# Altium schematic sheet Drone BLDC CNTR V2.SchDoc
size A3; SheetNumber: 1; SheetTotal: 1
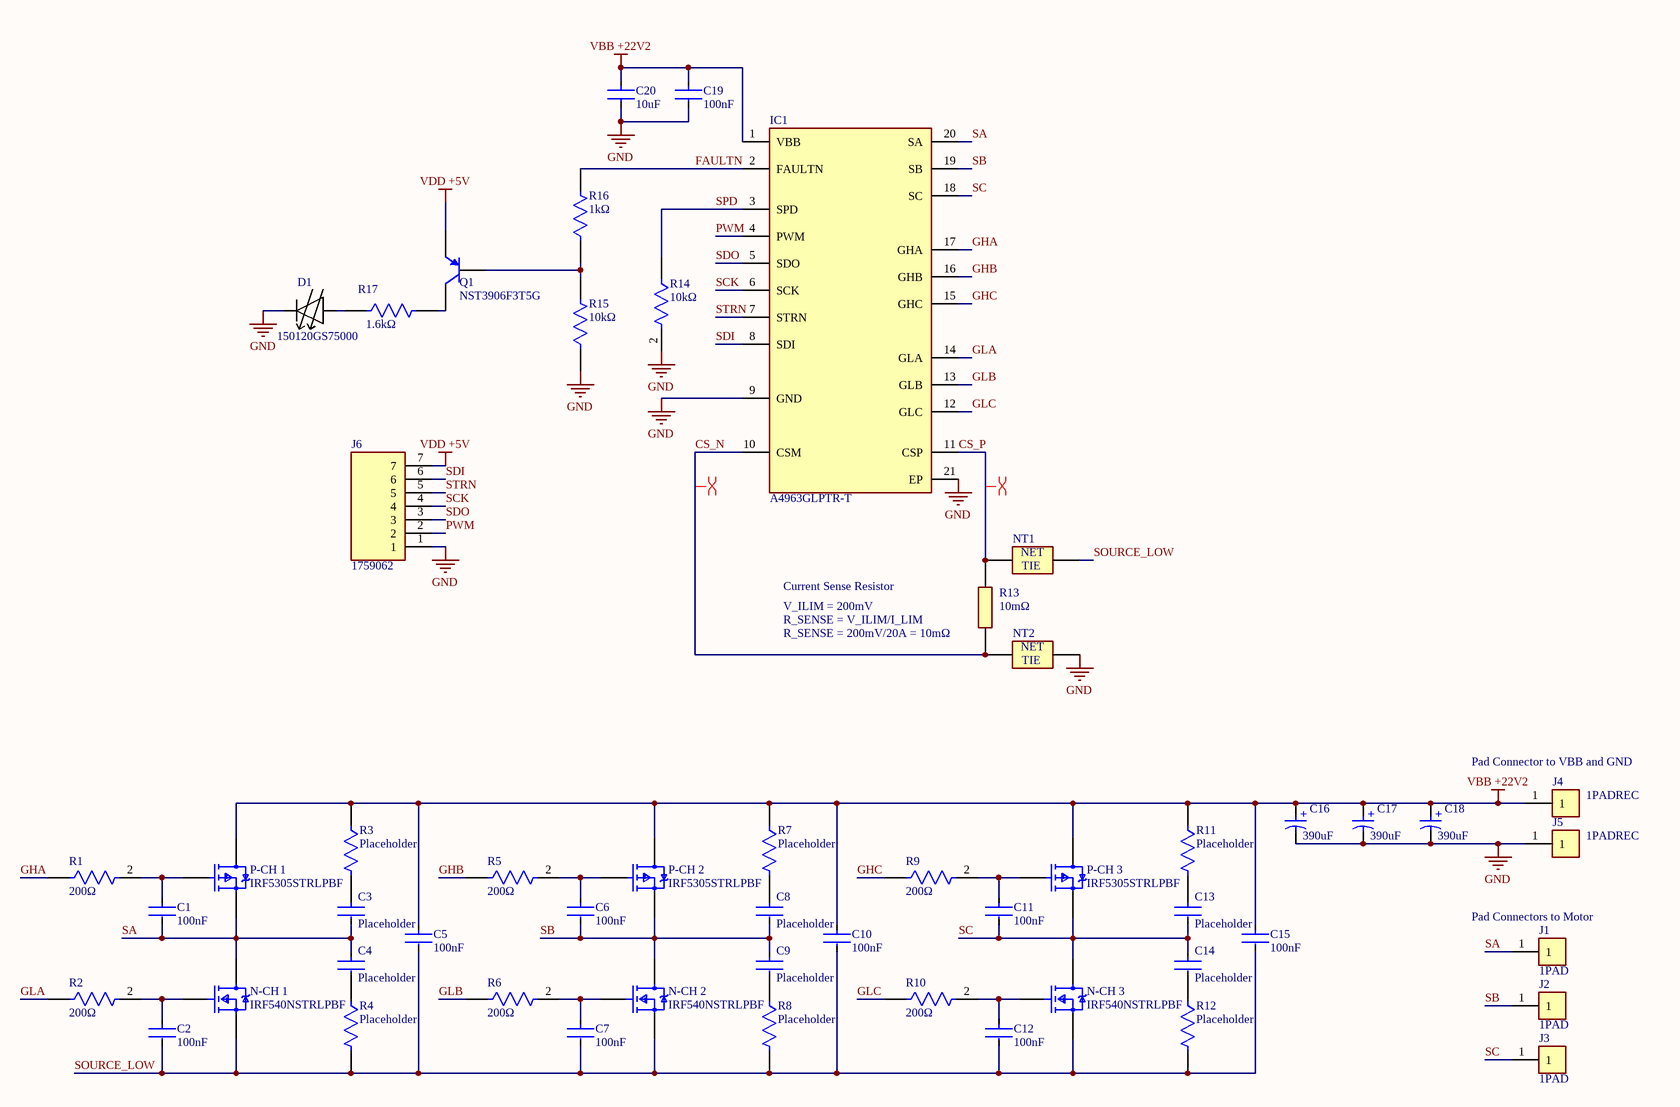
[diagram p0: Drone BLDC CNTR V2.SchDoc]

## Parts
C1  100nF  [FP-CL31-IPC_C]
C2  100nF  [FP-CL31-IPC_C]
C3  Placeholder  [FP-CL31-IPC_C]
C4  Placeholder  [FP-CL31-IPC_C]
C5  100nF  [FP-CL31-IPC_C]
C6  100nF  [FP-CL31-IPC_C]
C7  100nF  [FP-CL31-IPC_C]
C8  Placeholder  [FP-CL31-IPC_C]
C9  Placeholder  [FP-CL31-IPC_C]
C10  100nF  [FP-CL31-IPC_C]
C11  100nF  [FP-CL31-IPC_C]
C12  100nF  [FP-CL31-IPC_C]
C13  Placeholder  [FP-CL31-IPC_C]
C14  Placeholder  [FP-CL31-IPC_C]
C15  100nF  [FP-CL31-IPC_C]
C16  390uF  [WCAP-ASLI_D6.3H5.5]
C17  390uF  [WCAP-ASLI_D6.3H5.5]
C18  390uF  [WCAP-ASLI_D6.3H5.5]
C19  100nF  [FP-CL31-IPC_C]
C20  10uF  [FP-CL10-IPC_C]
D1  150120GS75000  [150120GS75000]
IC1  A4963GLPTR-T  [A4405KLPTRT]
J1  1PAD  [1PAD]
J2  1PAD  [1PAD]
J3  1PAD  [1PAD]
J4  1PADREC  [1PADREC]
J5  1PADREC  [1PADREC]
J6  1759062  [SHDRRA7W103P0X508_1X7_3556X1200X872P]
N-CH_1  IRF540NSTRLPBF  [FP-PG-TO263-3-MFG]
N-CH_2  IRF540NSTRLPBF  [FP-PG-TO263-3-MFG]
N-CH_3  IRF540NSTRLPBF  [FP-PG-TO263-3-MFG]
NT1  NET_TIE  [NET_TIE]  (value not drawn)
NT2  NET_TIE  [NET_TIE]  (value not drawn)
P-CH_1  IRF5305STRLPBF  [FP-PG-TO263-3-MFG]
P-CH_2  IRF5305STRLPBF  [FP-PG-TO263-3-MFG]
P-CH_3  IRF5305STRLPBF  [FP-PG-TO263-3-MFG]
Q1  NST3906F3T5G  [ONSC-SOT-1123-3-524AA_V]
R1  200Ω  [FP-RMCF0805-MFG]
R2  200Ω  [FP-RMCF0805-MFG]
R3  Placeholder  [FP-RMCF0805-MFG]
R4  Placeholder  [FP-RMCF0805-MFG]
R5  200Ω  [FP-RMCF0805-MFG]
R6  200Ω  [FP-RMCF0805-MFG]
R7  Placeholder  [FP-RMCF0805-MFG]
R8  Placeholder  [FP-RMCF0805-MFG]
R9  200Ω  [FP-RMCF0805-MFG]
R10  200Ω  [FP-RMCF0805-MFG]
R11  Placeholder  [FP-RMCF0805-MFG]
R12  Placeholder  [FP-RMCF0805-MFG]
R13  10mΩ  [RESC7250X190N]
R14  10kΩ  [FP-RMCF0805-MFG]
R15  10kΩ  [FP-RMCF0805-MFG]
R16  1kΩ  [FP-RMCF0805-IPC_C]
R17  1.6kΩ  [FP-RMCF0805-IPC_C]

## Nets
GND: C16.2(N) C17.2(N) C18.2(N) C19.2 C20.2 D1.1 IC1.9(GND) IC1.21(EP) J5.1 J6.1 NT2.1 R14.2 R15.1
VBB +22V2: C5.1 C10.1 C15.1 C16.1(P) C17.1(P) C18.1(P) C19.1 C20.1 IC1.1(VBB) J4.1 P-CH_1.4(DRAIN) P-CH_2.4(DRAIN) P-CH_3.4(DRAIN) R3.1 R7.1 R11.1
VDD +5V: J6.7 Q1.2(E)
CS_N: IC1.10(CSM) NT2.2 R13.1
CS_P: IC1.11(CSP) NT1.2 R13.2
FAULTN: IC1.2(FAULTN) R16.2
GHA: IC1.17(GHA) R1.1
GHB: IC1.16(GHB) R5.1
GHC: IC1.15(GHC) R9.1
GLA: IC1.14(GLA) R2.1
GLB: IC1.13(GLB) R6.1
GLC: IC1.12(GLC) R10.1
PWM: IC1.4(PWM) J6.2
SA: C1.2 C3.2 C4.1 IC1.20(SA) J1.1 N-CH_1.4(DRAIN) P-CH_1.3(SOURCE)
SB: C6.2 C8.2 C9.1 IC1.19(SB) J2.1 N-CH_2.4(DRAIN) P-CH_2.3(SOURCE)
SC: C11.2 C13.2 C14.1 IC1.18(SC) J3.1 N-CH_3.4(DRAIN) P-CH_3.3(SOURCE)
SCK: IC1.6(SCK) J6.4
SDI: IC1.8(SDI) J6.6
SDO: IC1.5(SDO) J6.3
SOURCE_LOW: C2.2 C5.2 C7.2 C10.2 C12.2 C15.2 N-CH_1.3(SOURCE) N-CH_2.3(SOURCE) N-CH_3.3(SOURCE) NT1.1 R4.2 R8.2 R12.2
SPD: IC1.3(SPD) R14.1
STRN: IC1.7(STRN) J6.5
NetC1_1: C1.1 P-CH_1.1(GATE) R1.2
NetC2_1: C2.1 N-CH_1.1(GATE) R2.2
NetC3_1: C3.1 R3.2
NetC4_2: C4.2 R4.1
NetC6_1: C6.1 P-CH_2.1(GATE) R5.2
NetC7_1: C7.1 N-CH_2.1(GATE) R6.2
NetC8_1: C8.1 R7.2
NetC9_2: C9.2 R8.1
NetC11_1: C11.1 P-CH_3.1(GATE) R9.2
NetC12_1: C12.1 N-CH_3.1(GATE) R10.2
NetC13_1: C13.1 R11.2
NetC14_2: C14.2 R12.1
NetD1_2: D1.2 R17.1
NetQ1_1: Q1.1(B) R15.2 R16.1
NetQ1_3: Q1.3(C) R17.2

## Layout directives
differential pair: CS_N, CS_P

## Notes on the sheet
- V_ILIM = 200mV
- Current Sense Resistor
- R_SENSE = V_ILIM/I_LIM
- (near R13) R_SENSE = 200mV/20A = 10mΩ
- (near J4) Pad Connector to VBB and GND
- (near J1) Pad Connectors to Motor
- (in symbol CMP-03913-53914574-1) +
- (in symbol NET_TIE) NET; TIE

## Library data of the parts
C1-C15 C19 = CMP-13271-001731-1: Cap Ceramic 100nF 50V X7R ±10% SMD 1206 +125°C Embossed T/R; Voltage: 50V; Thickness: 0.037inch; Lead Free: Lead Free; Length: 3.2mm; Min Operating Temperature: -55°C; Package Quantity: 15000; Packaging: Tape and Reel; Mount: Surface Mount; Depth: 1.6mm; Case/Package: 1206; Voltage Rating (DC): 50V; Tolerance: 10%; Height: 0.85mm; Capacitance: 100nF; Radiation Hardening: No; Dielectric: X7R; Voltage Rating: 50V; Max Operating Temperature: 125°C; Width: 0.063inch
C16-C18 = CMP-03913-53914574-1: 865080343009 WCAP-ASLI Aluminum Electrolytic Capacitors; Capacitance: 100µF; Polarity: Polar; Voltage Rating: 16V; Life (Hours): 2000hours; Tolerance: 20%; Impedance: 520mΩ; Ripple Current: 255mA; ESR (Equivalent Series Resistance): 399.422mΩ; Leakage Current: 16µA; Insulation Resistance: 1MΩ; Height: 5.5mm; NexarPartId: 53914574; Length: 5.5mm; Max Operating Temperature: 105°C; Min Operating Temperature: -55°C; Case/Package: Radial; RoHS: Compliant; Mount: Surface Mount; Lead Free: Lead Free; Voltage Rating (DC): 16V; Packaging: Tape & Reel (TR); Ripple Current (AC): 255mA; Diameter: 6.3mm; Height - Seated (Max): 5.5118mm; Width: 6.6mm; REACH SVHC: Unknown
C20 = CMP-13271-000193-1: Cap Ceramic 10nF 50V X7R ±20% Pad SMD 0603 +125°C T/R; Voltage Rating (DC): 50V; Radiation Hardening: No; Packaging: Tape and Reel; Depth: 0.8mm; Package Quantity: 4000; Max Operating Temperature: 125°C; Length: 1.6mm; Voltage Rating: 50V; Case/Package: 0603; Dielectric: X7R; Mount: Surface Mount; Tolerance: 20%; Thickness: 0.035inch; Capacitance: 10nF; Height: 0.8mm; Lead Free: Lead Free; Case Code (Metric): 1608; Width: 0.031inch; Min Operating Temperature: -55°C; Case Code (Imperial): 0603
D1 = CMP-036-000001-1: Green Status LED 1206; Source: LED - Chip.SchLib; Design Item ID: 150120GS75000; ComponentLink1Description: Schematic; ComponentLink1URL: https://katalog.we-online.de/led/datasheet/150120GS75000.pdf
IC1 = A4963GLPTR-T: Integrated Circuit; Manufacturer_Name: Allegro Microsystems; Datasheet Link: https://www.allegromicro.com/~/media/Files/Datasheets/A4963-Datasheet.ashx; Height: 1.2mm; Manufacturer_Part_Number: A4963GLPTR-T; Mouser Part Number: 250-A4963GLPTR-T; Mouser Price/Stock: https://www.mouser.co.uk/ProductDetail/Allegro-MicroSystems/A4963GLPTR-T?qs=pUKx8fyJudBsbRJaBUG8MA%3D%3D; Arrow Part Number: A4963GLPTR-T; Arrow Price/Stock: https://www.arrow.com/en/products/a4963glptr-t/allegro-microsystems?region=nac
J1-J3 = 1PAD: 1 Pad Connector
J4 J5 = 1PADREC: 1 Pad Rectangular Connector
J6 = 1759062: Connector; Manufacturer_Name: Phoenix Contact; Datasheet Link: http://www.phoenixcontact.com/de/produkte/1759062/pdf; Height: 8.72mm; Manufacturer_Part_Number: 1759062; Mouser Part Number: 651-1759062; Mouser Price/Stock: https://www.mouser.co.uk/ProductDetail/Phoenix-Contact/1759062?qs=cyzODkzcbwDJuRBXr3zqQw%3D%3D; Arrow Part Number: 1759062; Arrow Price/Stock: https://www.arrow.com/en/products/1759062/phoenix-contact
N-CH_1-N-CH_3 = CMP-00196-65873407-1: IRF540NSTRLPBF Transistor MOSFET N Channel 100 Volt 33 Amp 3-Pin 2+ Tab D2pak Tape And Reel; Drain to Source Voltage (Vdss): 100V; Rise Time: 35ns; Resistance: 44MΩ; Gate to Source Voltage (Vgs): 20V; Turn-Off Delay Time: 39ns; Recovery Time: 170ns; Number of Elements: 1; Max Junction Temperature (Tj): 175°C; Nominal Vgs: 4V; Element Configuration: Single; Current Rating: 33A; Power Dissipation: 3.8W; Turn-On Delay Time: 11ns; Input Capacitance: 1.96nF; Rds On Max: 8.4mΩ; Min Operating Temperature: -55°C; Lead Free: Lead Free; Packaging: Bulk; Voltage Rating (DC): 100V; Radiation Hardening: No; Height: 4.826mm; Schedule B: 8541290080, 8541290080; Mount: Surface Mount; Drain to Source Breakdown Voltage: 100V; Number of Pins: 3; Contact Plating: Tin; NexarPartId: 65873407; Max Operating Temperature: 175°C; Continuous Drain Current (ID): 33A; Termination: SMD/SMT; On-State Resistance: 44mΩ; Threshold Voltage: 4V; RoHS: Compliant; Dual Supply Voltage: 100V; Max Power Dissipation: 3.8W; Lifecycle Status: NRND; Width: 9.65mm; Drain to Source Resistance: 44mΩ; Fall Time: 35ns; Case/Package: D2PAK; Length: 10.668mm; Number of Channels: 1; Package Quantity: 800; REACH SVHC: No SVHC
NT1 NT2 = NET_TIE: Net Tie Pad
P-CH_1-P-CH_3 = CMP-32901-000146-1: MOSFET P-CH 55V 31A D2PAK; Manufacturer: Infineon Technologies; Input Capacitace At Vds: 1200pF @ -25V; Power Dissipation: 3.8W; Number Of Channels: 1; Gate Charge At Vgs: 63nC @ -10V; Turn Off Delay Time: 39ns; Threshold Vgs Min: -2V; Max Forward Diode Voltage: -1.3V; Reverse Recovery Charge: 170nC; Max Junction Temp: +175°C; Continuous Drain Current: -31A; Drain To Source Breakdown Voltage: -55V; Standoff Height: 0mm; Gate To Source Voltage: 20V; Reverse Recovery Time: 71ns; Depletion Mode: False; Drain To Source Resistance: 0.06Ω; Rthja Max: 40°C/W; Threshold Vgs Max: -4V; Turn On Delay Time: 14ns; Pulse Drain Current: -110A; Package: PG-TO263-3; Category: Trans; Automotive: No; Temperature Range High: +175°C; Number Of P Channels: 1; Height: 5.084mm; Device Class L2: Transistors; Device Class L3: MOSFETs; ComponentLink2URL: https://www.infineon.com/dgdl/irf5305spbf.pdf?fileId=5546d462533600a4015355e378101995; ComponentLink2Description: Datasheet; Temperature: -55°C to +175°C; RoHS: TRUE; Lead Free: Yes; Manufacturer Part Number: IRF5305STRLPBF; Temperature Range Low: -55°C; Digikey Description: MOSFET P-CH 55V 31A D2PAK; Drain To Source Voltage: -55V; Octopart: https://octopart.com/irf5305strlpbf-infineon-65873398; Device Class L1: Discrete Semiconductors
Q1 = CMP-1048-00442-1: PNP General Purpose Transistor, 3-Pin SOT-1123, Pb-Free, Tape and Reel; Manufacturer: On Semiconductor; IC Continuous (A): -0.2; fT Min (MHz): 250; Polarity: PNP; PartNumber: NST3906F3T5G; ComponentLink2URL: http://www.onsemi.com/pub_link/Collateral/NST3906F3-D.PDF; ComponentLink3Description: Package Specification; PackageReference: SOT-1123-3-524AA; RoHS: TRUE; ComponentLink2Description: Datasheet; DatasheetVersion: Rev. 1; PackageDescription: 3-Pin Small Outline Transistor, Body 0.8 x 0.6 mm, Pitch 0.375 mm; Packing: Tape and Reel; ComponentLink3URL: http://www.onsemi.cn/pub_link/Collateral/524AA.PDF; Mounting Technology: Surface Mount; ComponentLink1Description: Manufacturer URL; ComponentLink1URL: http://www.onsemi.com/; PackageVersion: Rev. C, 11/2011
R1-R12 R14 = CMP-26527-000524-1: 200Ω ±1% 0.125W 0805 Thick Film Chip Resistor AEC-Q200 compliant; Power Rating: 125mW; Temperature Coefficient: 100ppm/°C; Resistance: 200R; Packaging: Tape and Reel; Case Code (Imperial): 0805; Case/Package: 0805; Number of Terminations: 2; Depth: 1.25mm; Features: Automotive AEC-Q200; Max Power Dissipation: 125mW; Max Operating Temperature: 155°C; Series: RMCF; Mount: Surface Mount; Military Standard: Not; Radiation Hardening: No; Length: 0.079inch; Construction: Rectangular; Lead Free: Lead Free; Width: 0.049inch; Size Code: 0805; Height: 0.026inch; RoHS Compliant: Yes; Tolerance: 1%; Contact Plating: Tin; Resistor Type: Thick Film; Case Code (Metric): 2012; Min Operating Temperature: -55°C
R13 = HCSM2818FT10L0: 10mΩ 5W Resistor; Manufacturer_Name: Stackpole Electronics; Datasheet Link: https://cs.seielect.com/catalog/SEI-HCSM.pdf; Height: 1.9mm; Manufacturer_Part_Number: HCSM2818FT10L0; Arrow Part Number: HCSM2818FT10L0; Arrow Price/Stock: https://www.arrow.com/en/products/hcsm2818ft10l0/stackpole-electronics
R15 = CMP-26527-000121-1: RES 10K OHM 1% 1/8W 0805; Power Rating: 125mW; Resistance: 10kR; Temperature Coefficient: 100ppm/°C; Depth: 1.25mm; Construction: Rectangular; Packaging: Tape and Reel; Tolerance: 1%; Lead Free: Lead Free; Case/Package: 0805; RoHS Compliant: Yes; Series: RMCF; Width: 0.049inch; Max Power Dissipation: 125mW; Contact Plating: Tin; Height: 0.026inch; Mount: Surface Mount; Resistor Type: Thick Film; Size Code: 0805; Length: 2mm; Max Operating Temperature: 155°C; Features: Automotive AEC-Q200; Radiation Hardening: No; Case Code (Imperial): 0805; Min Operating Temperature: -55°C; Case Code (Metric): 2012; Number of Terminations: 2; Military Standard: Not
R16 = CMP-26527-002331-1: 1kΩ ±1% 0.125W 0805 Thick Film Chip Resistor AEC-Q200 compliant; Resistance: 1kR; Max Power Dissipation: 125mW; Temperature Coefficient: 100ppm/°C; Contact Plating: Tin; Case Code (Imperial): 0805; Radiation Hardening: No; Case/Package: 0805; Min Operating Temperature: -55°C; Construction: Rectangular; Tolerance: 1%; Length: 2mm; Features: Automotive AEC-Q200; Height: 0.026inch; Mount: Surface Mount; Series: RMCF; Number of Terminations: 2; Width: 0.049inch; Packaging: Tape and Reel; Size Code: 0805; Lead Free: Lead Free; Depth: 1.25mm; Power Rating: 125mW; Resistor Type: Thick Film; Case Code (Metric): 2012; Military Standard: Not; Max Operating Temperature: 155°C; RoHS Compliant: Yes
R17 = CMP-26527-000088-1: 2.2kΩ ±5% 0.125W 0805 Thick Film Chip Resistor AEC-Q200 compliant; Resistance: 2.2kR; Power Rating: 125mW; Temperature Coefficient: 100ppm/°C; Depth: 1.25mm; Mount: Surface Mount; Length: 2mm; Construction: Rectangular; Max Operating Temperature: 155°C; Case Code (Metric): 2012; Radiation Hardening: No; Min Operating Temperature: -55°C; Series: RMCF; Contact Plating: Tin; Number of Terminations: 2; RoHS Compliant: Yes; Height: 0.026inch; Width: 0.049inch; Case Code (Imperial): 0805; Tolerance: 5%; Packaging: Tape and Reel; Case/Package: 0805; Lead Free: Lead Free; Size Code: 0805; Military Standard: Not; Max Power Dissipation: 125mW; Features: Automotive AEC-Q200; Resistor Type: Thick Film